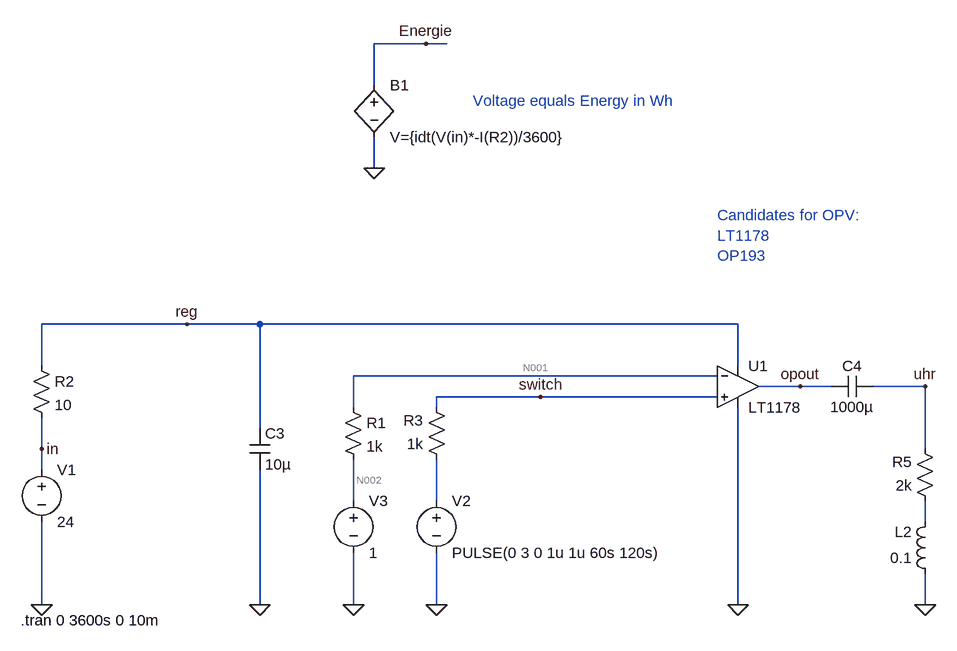
[diagram p0: schematic Simulation_OPV_only.asc]
Simulation_OPV_only.asc, the LTspice schematic file:
Version 4
SHEET 1 928 772
WIRE 64 -432 -16 -432
WIRE 96 -432 64 -432
WIRE -16 -368 -16 -432
WIRE -16 -240 -16 -288
WIRE -304 0 -528 0
WIRE -192 0 -304 0
WIRE 544 0 -192 0
WIRE -528 64 -528 0
WIRE 544 64 544 0
WIRE 512 80 -48 80
WIRE 640 96 576 96
WIRE 688 96 640 96
WIRE 832 96 752 96
WIRE 240 112 80 112
WIRE 512 112 240 112
WIRE -48 128 -48 80
WIRE 80 128 80 112
WIRE -192 160 -192 0
WIRE -528 192 -528 144
WIRE 832 192 832 96
WIRE -528 224 -528 192
WIRE -48 272 -48 208
WIRE 80 272 80 208
WIRE 832 304 832 272
WIRE -528 432 -528 304
WIRE -192 432 -192 224
WIRE -48 432 -48 352
WIRE 80 432 80 352
WIRE 544 432 544 128
WIRE 832 432 832 384
FLAG -528 432 0
FLAG -192 432 0
FLAG -304 0 reg
FLAG 80 432 0
FLAG 832 432 0
FLAG 544 432 0
FLAG -48 432 0
FLAG 832 96 uhr
FLAG 240 112 switch
FLAG 640 96 opout
FLAG -16 -240 0
FLAG 64 -432 Energie
FLAG -528 192 in
SYMBOL voltage -528 208 R0
WINDOW 123 0 0 Left 0
WINDOW 39 0 0 Left 0
SYMATTR InstName V1
SYMATTR Value 24
SYMBOL res -544 48 R0
SYMATTR InstName R2
SYMATTR Value 10
SYMBOL cap -208 160 R0
SYMATTR InstName C3
SYMATTR Value 10µ
SYMATTR SpiceLine V=50 Irms=0 Rser=0.0051 Lser=500p mfg="Würth Elektronik" pn="885012210031 WCAP-CSGP 1812" type="X7R"
SYMBOL ind 848 400 R180
WINDOW 0 36 80 Left 2
WINDOW 3 36 40 Left 2
SYMATTR InstName L2
SYMATTR Value 0.1
SYMBOL res 848 288 R180
WINDOW 0 36 76 Left 2
WINDOW 3 36 40 Left 2
SYMATTR InstName R5
SYMATTR Value 2k
SYMBOL voltage 80 256 R0
WINDOW 123 0 0 Left 0
WINDOW 39 0 0 Left 0
SYMATTR InstName V2
SYMATTR Value PULSE(0 3 0 1u 1u 60s 120s)
SYMBOL cap 752 80 R90
WINDOW 0 0 32 VBottom 2
WINDOW 3 32 32 VTop 2
SYMATTR InstName C4
SYMATTR Value 1000µ
SYMBOL voltage -48 256 R0
WINDOW 123 0 0 Left 0
WINDOW 39 0 0 Left 0
SYMATTR InstName V3
SYMATTR Value 1
SYMBOL bv -16 -384 R0
SYMATTR InstName B1
SYMATTR Value V={idt(V(in)*-I(R2))/3600}
SYMBOL res -64 112 R0
SYMATTR InstName R1
SYMATTR Value 1k
SYMBOL res 96 224 R180
WINDOW 0 36 76 Left 2
WINDOW 3 36 40 Left 2
SYMATTR InstName R3
SYMATTR Value 1k
SYMBOL OpAmps\\LT1178 544 32 R0
SYMATTR InstName U1
TEXT -560 456 Left 2 !.tran 0 3600s 0 10m
TEXT 136 -344 Left 2 ;Voltage equals Energy in Wh
TEXT 512 -168 Left 2 ;Candidates for OPV:\nLT1178\nOP193

The netlist it stands for:
* Simulation_OPV_only.asc
V1 in 0 24
R2 reg in 10
C3 reg 0 10µ V=50 Irms=0 Rser=0.0051 Lser=500p mfg="Würth Elektronik" pn="885012210031 WCAP-CSGP 1812" type="X7R"
L2 0 N004 0.1
R5 N004 uhr 2k
V2 N003 0 PULSE(0 3 0 1u 1u 60s 120s)
C4 uhr opout 1000µ
V3 N002 0 1
B1 Energie 0 V={idt(V(in)*-I(R2))/3600}
R1 N001 N002 1k
R3 N003 switch 1k
XU1 switch N001 reg 0 opout LT1178  ; pins In+ In- V+ V- OUT
.tran 0 3600s 0 10m
* Voltage equals Energy in Wh
* Candidates for OPV:
* LT1178
* OP193
.backanno
.end

* Results of the author's LTspice run, read from the files saved beside the schematic
* Operating Point, zero values left out:
*   V(in) = 24 V
*   V(reg) = 24 V
*   V(opout) = 6.232 mV
*   V(n002) = 1 V
*   V(n001) = 1 V
*   V(switch) = 4.501 µV
*   I(R2) = -13 µA
*   I(R1) = 3.418 nA
*   I(R3) = -4.501 nA
*   I(V1) = -13 µA
*   I(V2) = 4.501 nA
*   I(V3) = 3.418 nA
*   Ix(u1:1) = -4.501 nA
*   Ix(u1:2) = -3.418 nA
*   Ix(u1:3) = 13 µA
*   Ix(u1:4) = -12.07 µA
*   Ix(u1:5) = 23.99 pA
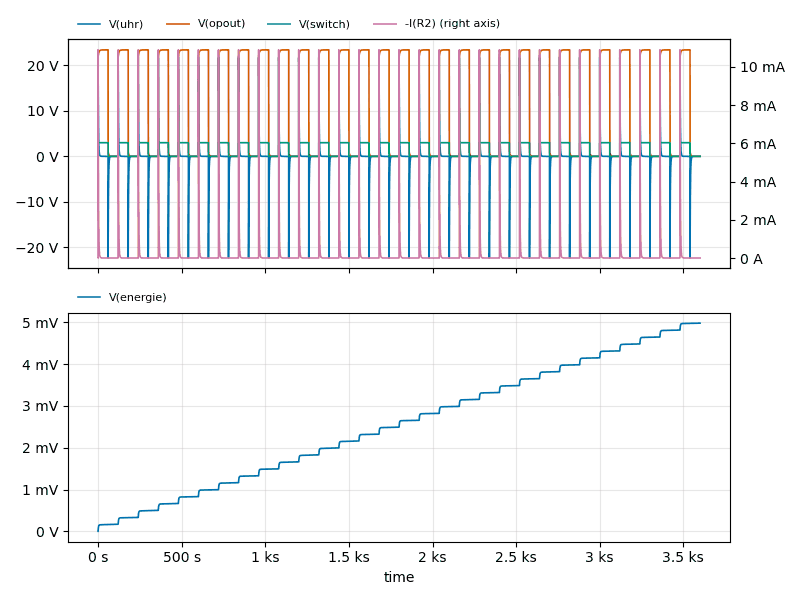
[diagram p1: Transient Analysis of Simulation_OPV_only.asc, plotted from the saved traces]
* Transient Analysis, 1 run:
*   V(uhr): min -22.37 V, max 21.78 V, average -4.816 µV, rms 2.953 V, last -41.69 µV
*   V(opout): min 6.232 mV, max 23.42 V, average 11.69 V, rms 16.48 V, last 6.372 mV
*   V(switch): min 0 V, max 3 V, average 1.5 V, rms 2.121 V, last 4.501 µV
*   -I(R2): min 12.08 µA, max 10.89 mA, average 209.1 µA, rms 1.037 mA, last 13 µA
*   V(energie): min 0 V, max 4.981 mV, average 2.565 mV, rms 2.941 mV, last 4.981 mV